# EAGLE design tc1-1-13-breakout (EAGLE 5.11)
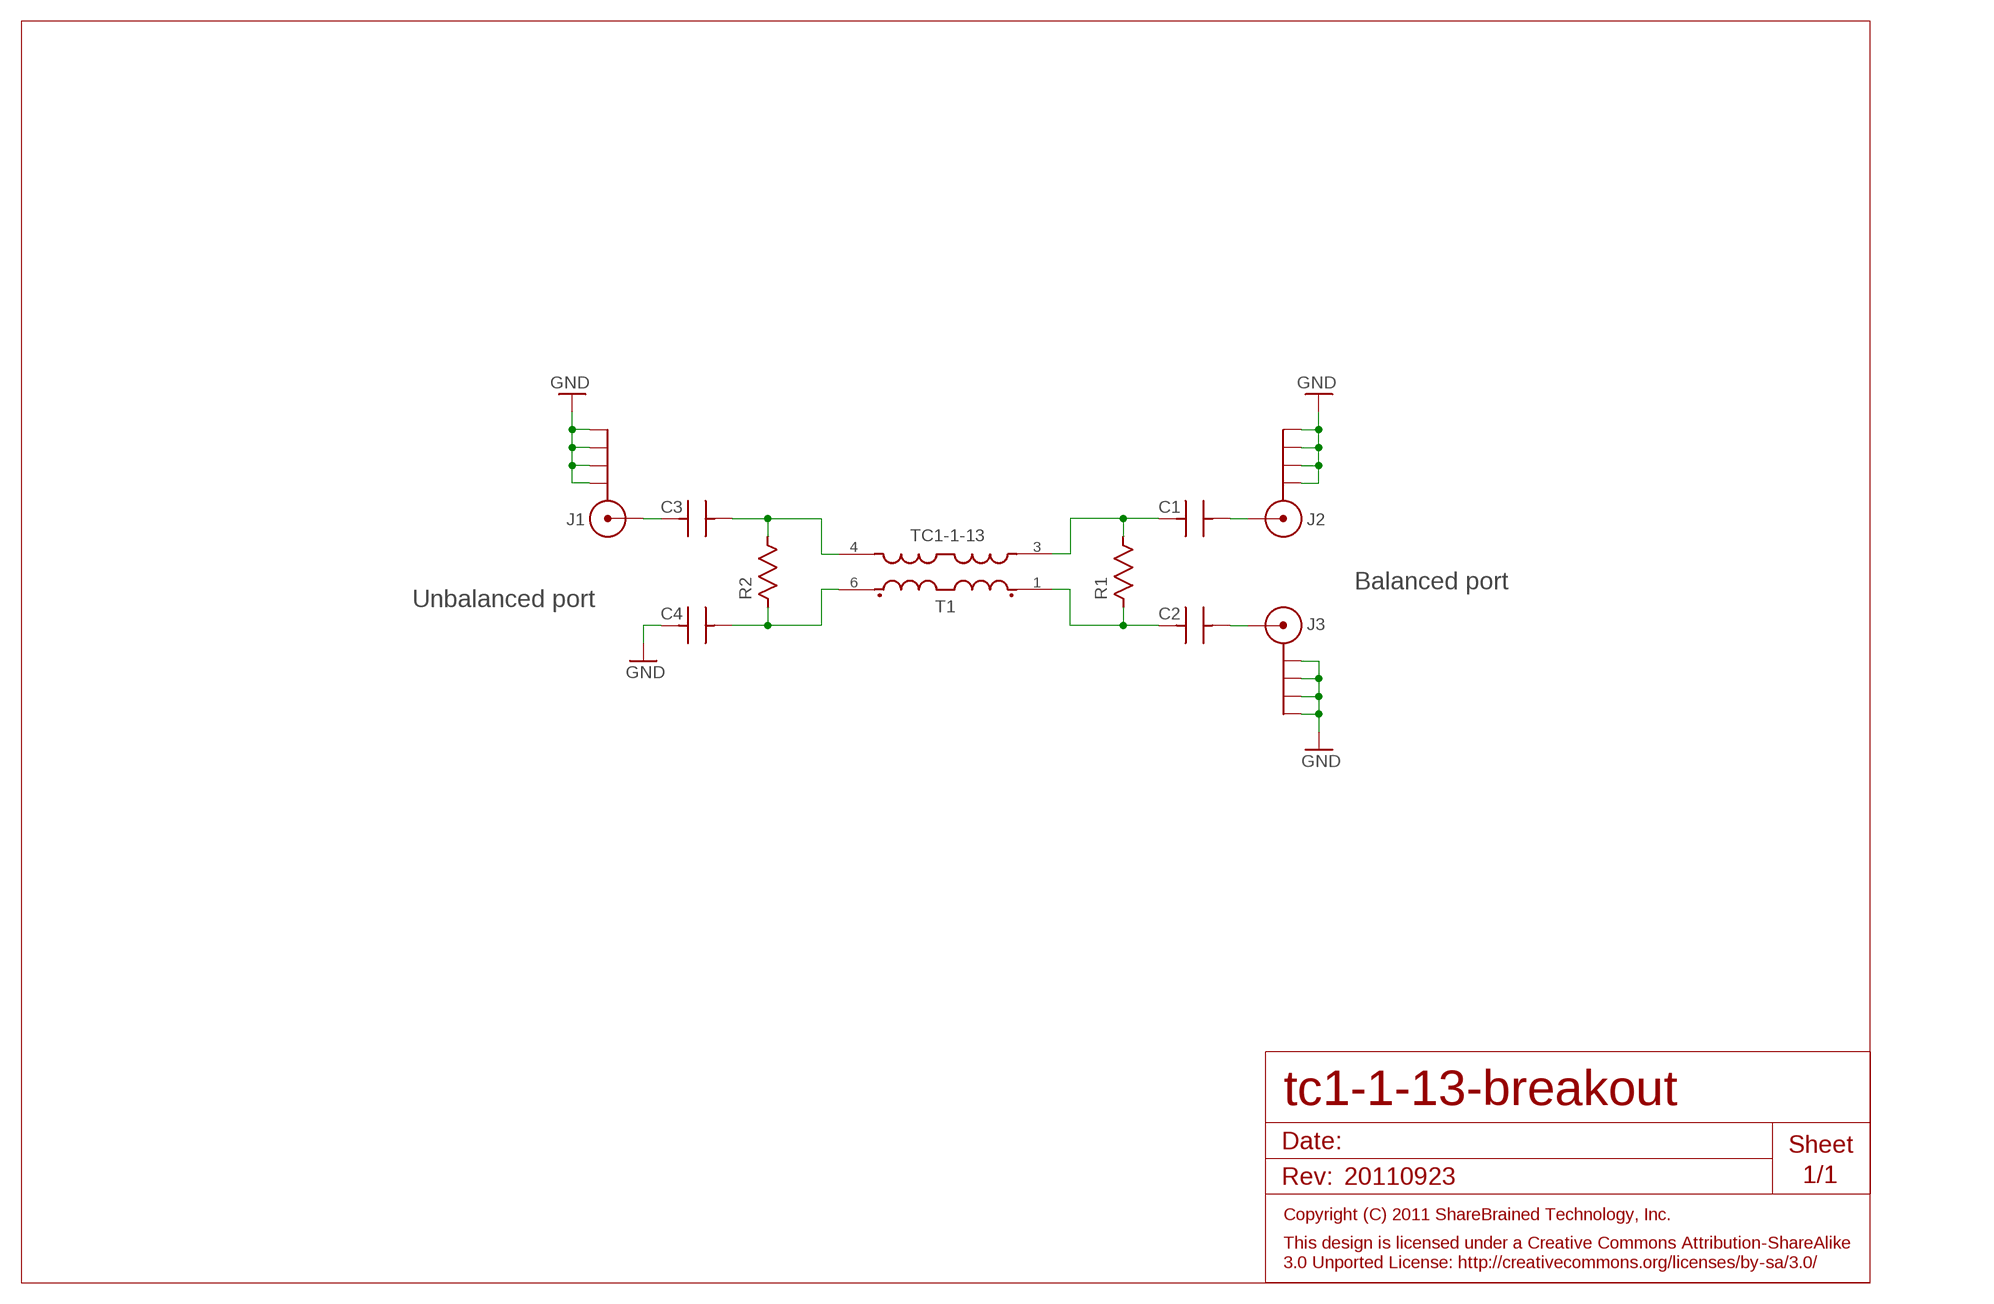
[diagram p0: schematic, sheet 1]

## Parts
C1  C0402_55  [CAPC1005X55N]
C2  C0402_55  [CAPC1005X55N]
C3  C0402_55  [CAPC1005X55N]
C4  C0402_55  [CAPC1005X55N]
J1  SMA142-0701-801  [142-0701-801]
J2  SMA142-0701-801  [142-0701-801]
J3  SMA142-0701-801  [142-0701-801]
R1  R0402_40  [RESC1005X40N]
R2  R0402_40  [RESC1005X40N]
T1  TC1-1-13  [AT224]

## Nets
GND: C4.1 J1.RING@1(RING) J1.RING@2(RING) J1.RING@3(RING) J1.RING@4(RING) J2.RING@1(RING) J2.RING@2(RING) J2.RING@3(RING) J2.RING@4(RING) J3.RING@1(RING) J3.RING@2(RING) J3.RING@3(RING) J3.RING@4(RING)
N$1: C3.2 R2.2 T1.4(P)
N$2: C2.2 J3.TIP
N$3: C1.2 J2.TIP
N$4: C1.1 R1.2 T1.3(S)
N$5: C2.1 R1.1 T1.1(SD)
N$6: C4.2 R2.1 T1.6(PD)
N$7: C3.1 J1.TIP

## Notes on the sheet
- Balanced port
- Unbalanced port
- 20110923

## Library data of the parts
C1-C4 = capacitor:C
J1-J3 = sma:SMA
R1 R2 = resistor:R
T1 = minicircuits:TC1-1-13

## Board
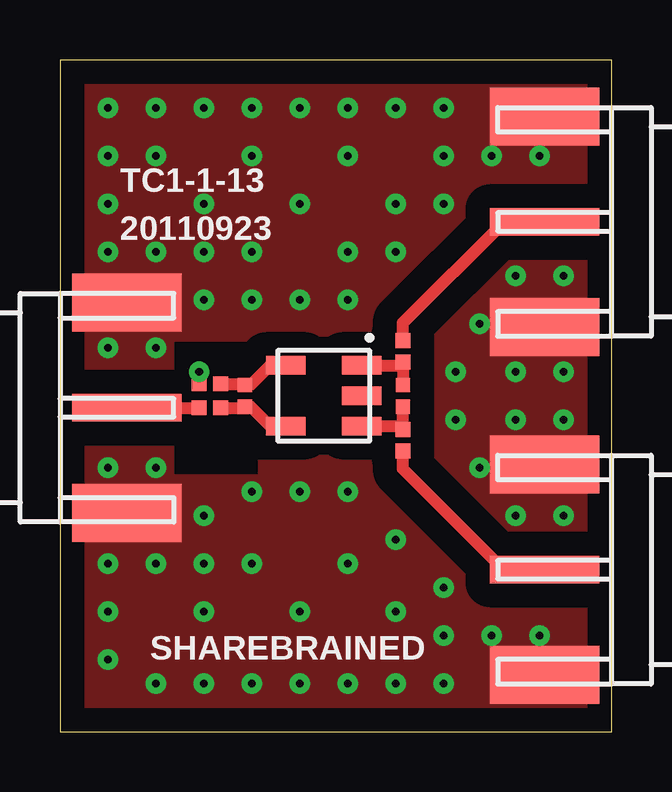
[diagram p1: board, top side]
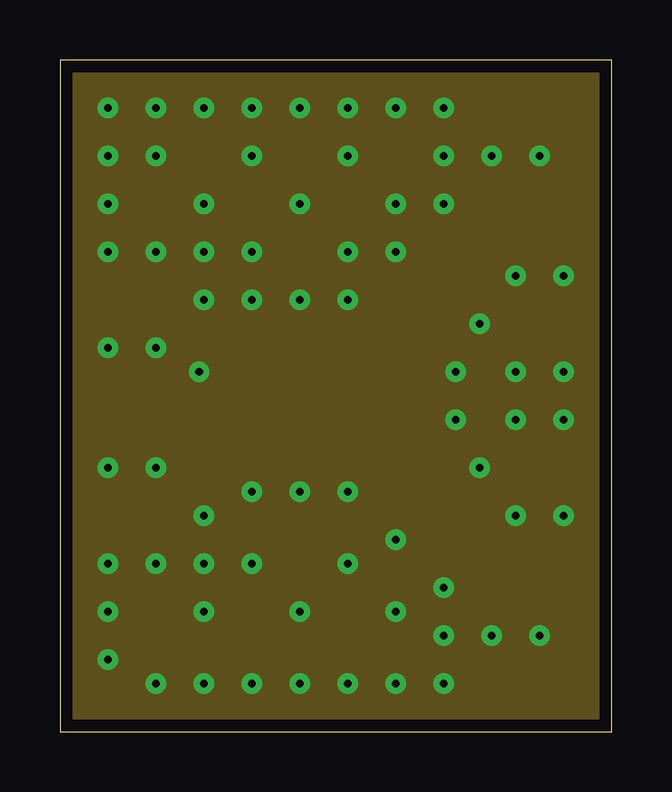
[diagram p2: board, inner layer Route2]
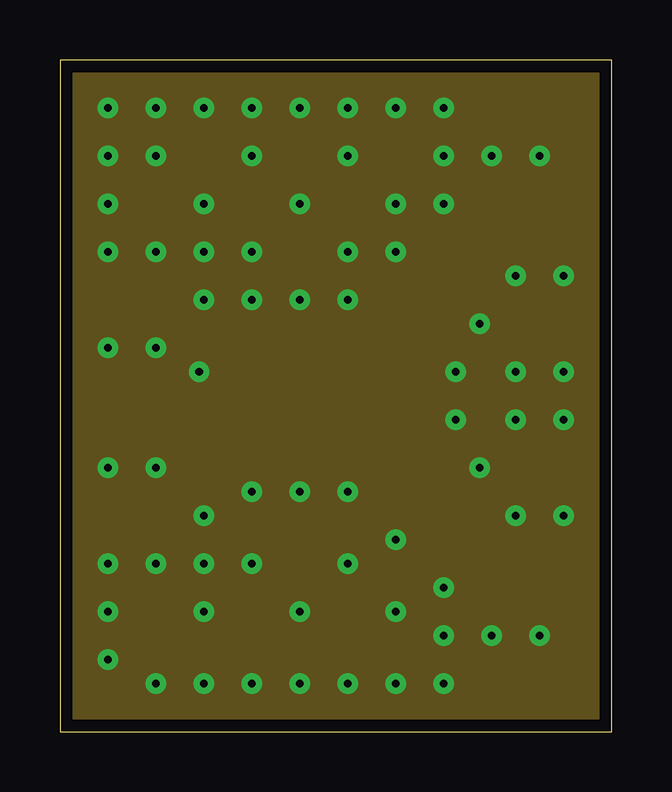
[diagram p3: board, inner layer Route15]
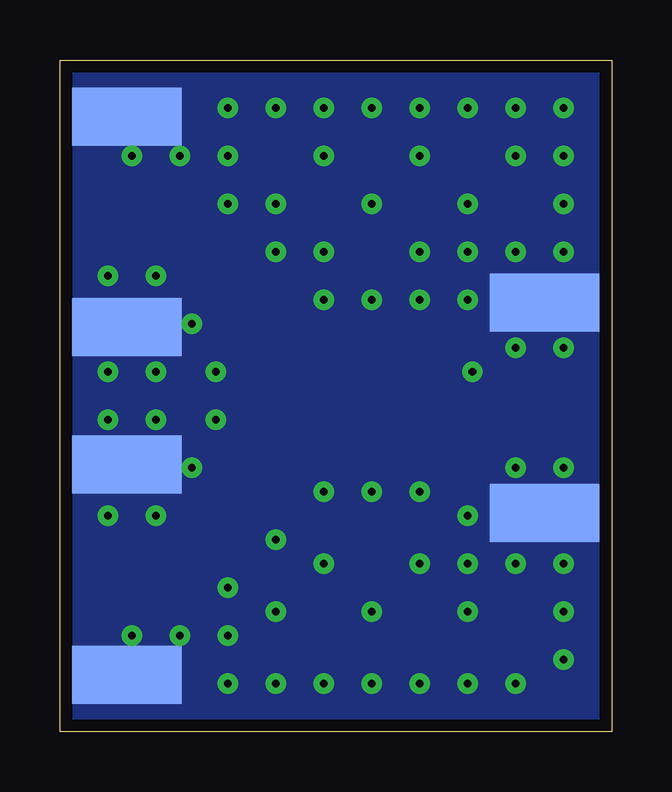
[diagram p4: board, bottom side, seen from below]

Size 23 x 28 mm. Coordinates in mm from the lower left corner, seen from the top.
Outline: 0,0 23,0 23,28 0,28 0,0
Copper layers (1+2*15+16): Top 0.0178mm / dielectric 0.3048mm / Route2 0.0356mm / dielectric 0.7112mm / Route15 0.0356mm / dielectric 0.3048mm / Bottom 0.0178mm
Design rules "tc1-1-13-breakout": minimum track width 0.3mm, minimum drill 13mil, track to track 0.2mm, track to pad 0.2mm, pad to pad 0.2mm, via to via 0.2mm, smd to smd 0.2mm, copper to edge 20mil, drill to drill 16mil, minimum pad ring 10mil, minimum via ring 10mil, stop-mask expansion 3mil, vias tented up to drill 13mil, thermal gap 8mil

### Footprints (pad centres in the part's own frame; a part is rotated, then mirrored left to right if it is on the bottom)
CAPC1005X55N = smd 0.62 x 0.62: 1 -0.45,0; 2 0.45,0
142-0701-801 = smd 2.413 x 4.572: RING@1 -4.381,-2.794; RING@2 4.381,-2.794 | smd 2.413 x 4.572 bottom: RING@3 -4.381,-2.794; RING@4 4.381,-2.794 | smd 1.143 x 4.572: TIP 0,-2.794
RESC1005X40N = smd 0.6 x 0.6: 1 -0.45,0; 2 0.45,0
AT224 = smd 0.762 x 1.651: 1 -1.27,1.587; 2 0,1.587; 3 1.27,1.587; 4 1.27,-1.587; 6 -1.27,-1.587

### Placement (x,y rotation side)
C1  14.3,12.15 270 top
C2  14.3,15.85 90 top
C3  6.25,13.5 0 top
C4  6.25,14.5 0 top
J1  0,13.5 90 top
J2  23,6.75 270 top
J3  23,21.25 270 top
R1  14.3,14 270 top
R2  7.7,14 270 top
T1  11,14 270 top

### Tracks (layer width: path | path; a pad name or v marks a point on that pad's centre or on a via)
GND  (via drill 0.33)
  Top 0.5: C4.1 v5.8,15
  other vias: 2,26 2,24 2,22 2,20 4,20 6,20 6,18 2,16 4,16 2,11 4,11 6,9 6,7 4,7 2,7 2,5 2,3 4,2 6,2 8,2 10,2 12,2 14,2 16,2 16,4 18,4 20,4 16,6 14,8 12,10 10,10 8,10 19,9 21,9 21,13 19,13 17.5,11 19,15 21,15 17.5,17 19,19 21,19 16.5,15 16.5,13 20,24 18,24 16,24 16,26 14,26 12,26 10,26 8,26 6,26 4,26 16,22 14,20 12,18 10,18 8,18 4,24 6,22 8,24 10,22 8,20 14,22 12,20 12,24 6,5 8,7 10,5 14,5 12,7
  pour Top (isolate 1, no thermals): 0,0 0,12 4.5,12 4.5,10.5 8.5,10.5 8.5,16.5 4.5,16.5 4.5,15 0,15 0,28 23,28 23,0
  pour Route2 (no thermals): 0,0 0,28 23,28 23,0
  pour Route15 (no thermals): 0,0 0,28 23,28 23,0
  pour Bottom (no thermals): 0,0 0,28 23,28 23,0
N$1
  Top 0.5: C3.2 7.65,13.5 R2.2 7.95,13.55 8.77,12.73 T1.4
N$2
  Top 0.5: C2.2 14.3,17.05 18.5,21.25 J3.TIP
N$3
  Top 0.5: C1.2 14.3,10.95 18.5,6.75 J2.TIP
N$4
  Top 0.5: R1.2 C1.1 14.17,12.73 T1.3
N$5
  Top 0.5: R1.1 C2.1 14.17,15.27 T1.1
N$6
  Top 0.5: C4.2 7.65,14.5 R2.1 7.95,14.45 8.77,15.27 T1.6
N$7
  Top 0.5: J1.TIP C3.1

### Text on the board
tPlace: TC1-1-13 | 20110923 | SHAREBRAINED